# EAGLE design INTERFACE_STM32F103CBT6 (EAGLE 7.6.0)
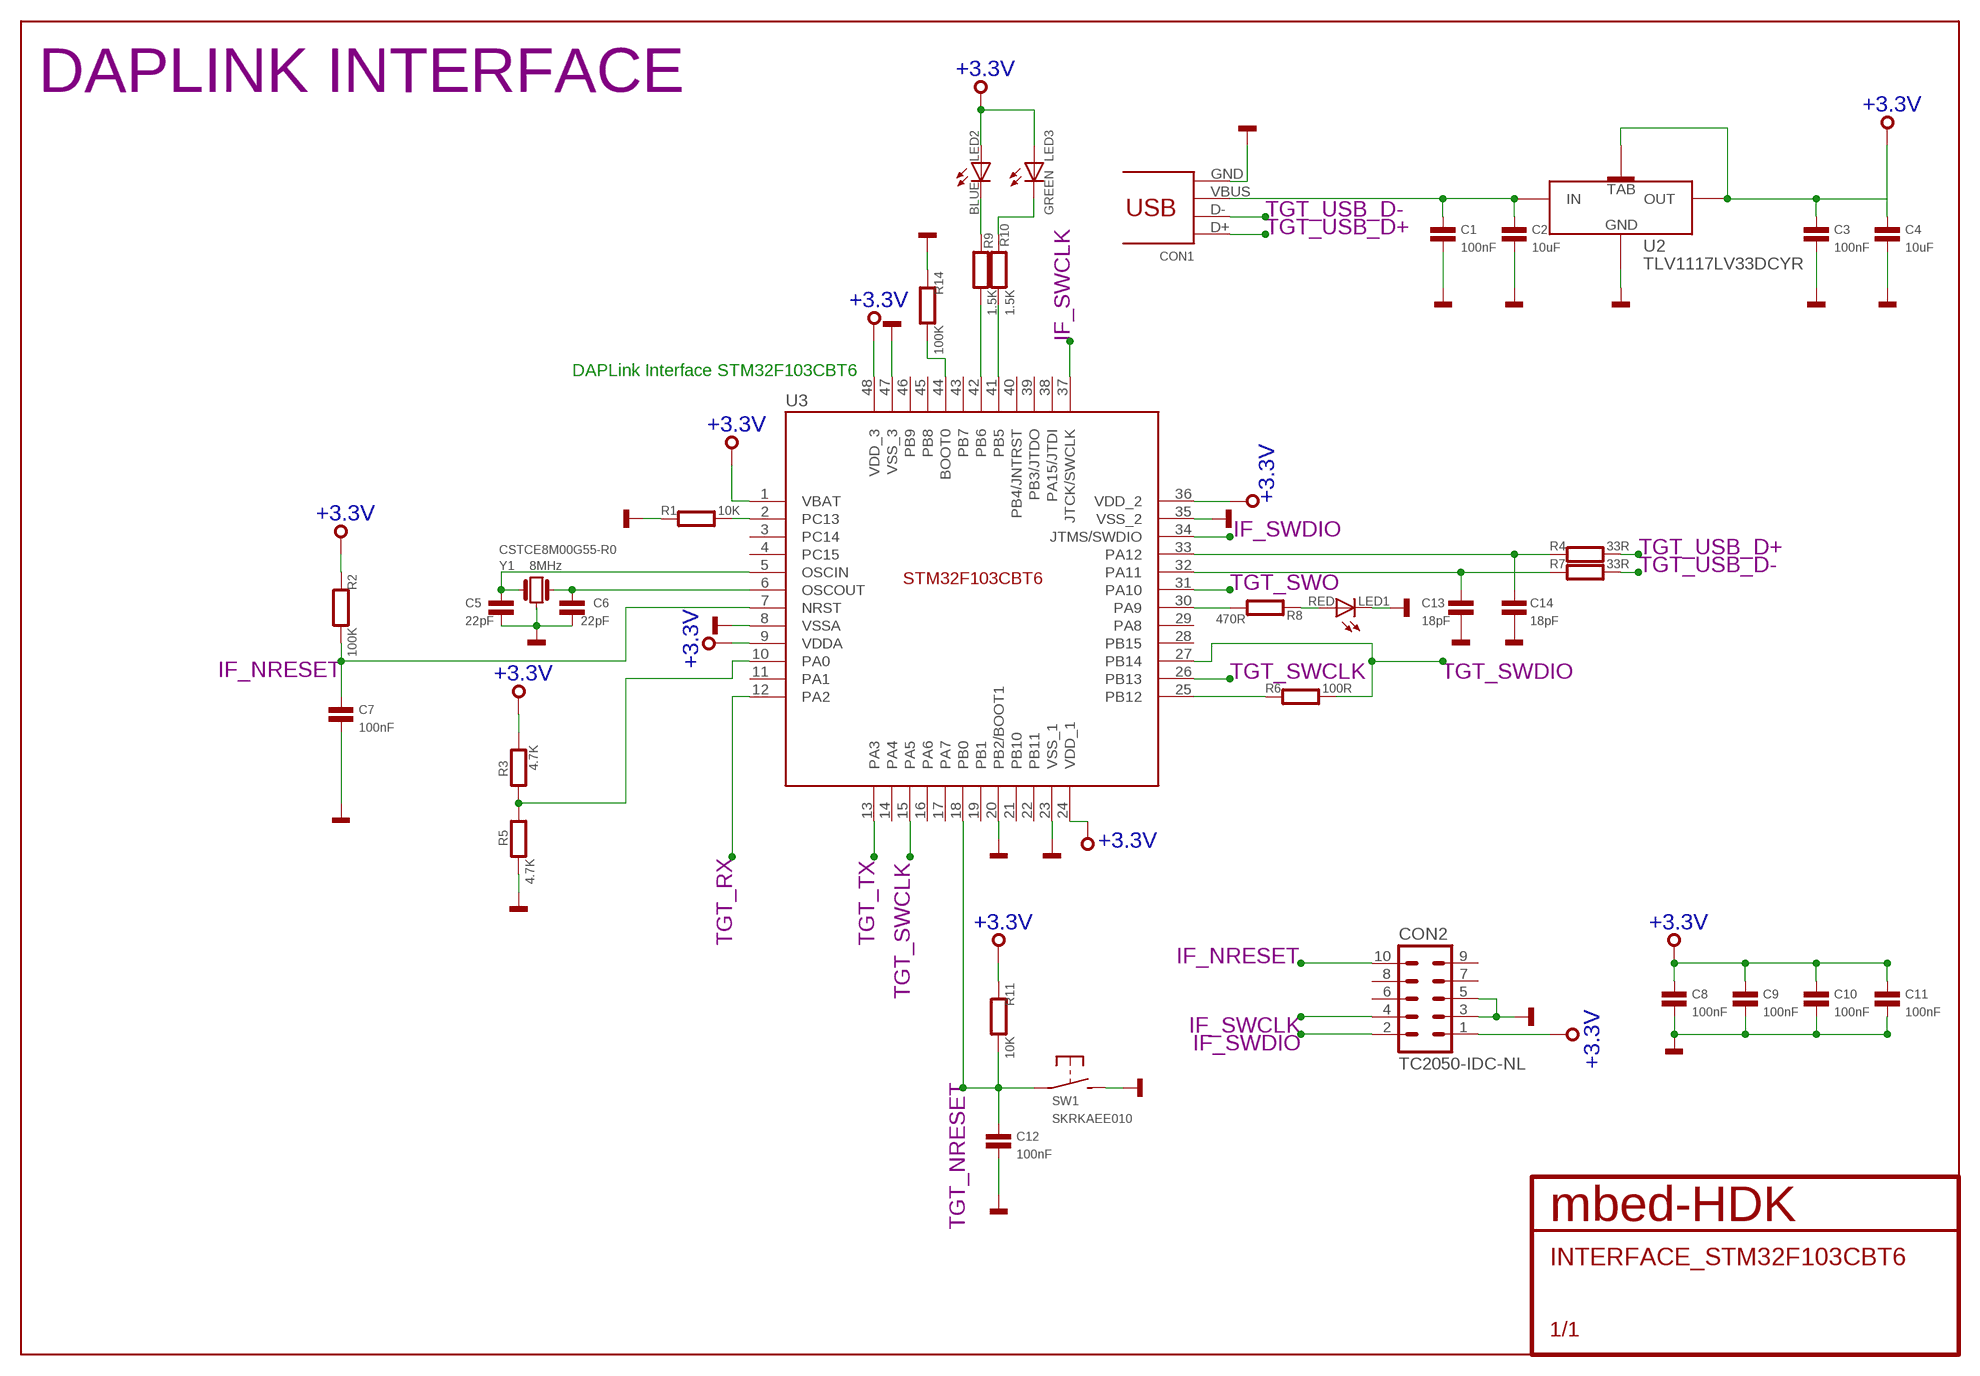
[diagram p0: schematic, sheet 1]

## Parts
C1  100nF  CAPACITOR0402  [0402]
C2  10uF  CAPACITOR0603  [0603]
C3  100nF  CAPACITOR0402  [0402]
C4  10uF  CAPACITOR0603  [0603]
C5  22pF  CAPACITOR0402  [0402]
C6  22pF  CAPACITOR0402  [0402]
C7  100nF  CAPACITOR0402  [0402]
C8  100nF  CAPACITOR0402  [0402]
C9  100nF  CAPACITOR0402  [0402]
C10  100nF  CAPACITOR0402  [0402]
C11  100nF  CAPACITOR0402  [0402]
C12  100nF  CAPACITOR0402  [0402]
C13  18pF  CAPACITOR0402  [0402]
C14  18pF  CAPACITOR0402  [0402]
CON1  47346-0001  [USB-MICRO-B-H]
CON2  TC2050-IDC-NL  [TC2050-IDC-NL]
LED1  RED  SMD_LED0603  [CHIPLED_0603]
LED2  BLUE  SMD_LED0603  [CHIPLED_0603]
LED3  GREEN  SMD_LED0603  [CHIPLED_0603]
R1  10K  RESISTOR0402  [0402]
R2  100K  RESISTOR0402  [0402]
R3  4.7K  RESISTOR0402  [0402]
R4  33R  RESISTOR0402  [0402]
R5  4.7K  RESISTOR0402  [0402]
R6  100R  RESISTOR0402  [0402]
R7  33R  RESISTOR0402  [0402]
R8  470R  RESISTOR0402  [0402]
R9  1.5K  RESISTOR0402  [0402]
R10  1.5K  RESISTOR0402  [0402]
R11  10K  RESISTOR0402  [0402]
R14  100K  RESISTOR0402  [0402]
SW1  SKRKAEE010  [SKRKAEE010]
U2  TLV1117LV33DCYR  [SOT223]
U3  STM32F103CBT6  [LQFP48]
Y1  CSTCE8M00G55-R0  [CSTCE8M00G55-R0]

## Nets
+3.3V: C3.1 C4.1 C8.1 C9.1 C10.1 C11.1 CON2.1 LED2.A LED3.A R2.1 R3.1 R11.1 U2.OUT(1)(OUT) U2.OUT(2)(TAB) U3.1(VBAT) U3.9(VDDA) U3.24(VDD_1) U3.36(VDD_2) U3.48(VDD_3)
GND: C1.2 C2.2 C3.2 C4.2 C5.2 C6.2 C7.2 C8.2 C9.2 C10.2 C11.2 C12.2 C13.2 C14.2 CON1.GND CON2.3 CON2.5 LED1.C R1.1 R5.2 R14.1 SW1.P$2(S) U2.GND U3.8(VSSA) U3.20(PB2/BOOT1) U3.23(VSS_1) U3.35(VSS_2) U3.47(VSS_3) Y1.2
IF_NRESET: C7.1 CON2.10 R2.2 U3.7(NRST)
IF_SWCLK: CON2.4 U3.37(JTCK/SWCLK)
IF_SWDIO: CON2.2 U3.34(JTMS/SWDIO)
N$1: C1.1 C2.1 CON1.VBUS U2.IN
N$2: R8.2 U3.30(PA9)
N$3: R14.2 U3.44(BOOT0)
N$4: R1.2 U3.2(PC13)
N$5: C6.1 U3.6(OSCOUT) Y1.3
N$6: C5.1 U3.5(OSCIN) Y1.1
N$8: R3.2 R5.1 U3.10(PA0)
N$9: R9.2 U3.42(PB6)
N$10: R10.2 U3.41(PB5)
N$11: LED1.A R8.1
N$12: R6.1 U3.25(PB12)
N$13: LED2.C R9.1
N$14: LED3.C R10.1
N$15: C14.1 R4.1 U3.33(PA12)
N$17: C13.1 R7.1 U3.32(PA11)
TGT_NRESET: C12.1 R11.2 SW1.P$1(P) U3.18(PB0)
TGT_RX: U3.12(PA2)
TGT_SWCLK: U3.15(PA5) U3.26(PB13)
TGT_SWDIO: R6.2 U3.27(PB14)
TGT_SWO: U3.31(PA10)
TGT_TX: U3.13(PA3)
TGT_USB_D+: CON1.D+ R4.2
TGT_USB_D-: CON1.D- R7.2
Unconnected: CON2.6 CON2.7 CON2.8 CON2.9 U3.3(PC14) U3.4(PC15) U3.11(PA1) U3.14(PA4) U3.16(PA6) U3.17(PA7) U3.19(PB1) U3.21(PB10) U3.22(PB11) U3.28(PB15) U3.29(PA8) U3.38(PA15/JTDI) U3.39(PB3/JTDO) U3.40(PB4/JNTRST) U3.43(PB7) U3.45(PB8) U3.46(PB9)

## Notes on the sheet
- DAPLINK INTERFACE
- DAPLink Interface STM32F103CBT6
- 8MHz

## Library data of the parts
C1 C3 C7-C12 = mbed-HDK-RLCQ:CAPACITOR: Capacitor
C2 C4-C6 C13 C14 = mbed-HDK-RLC:CAPACITOR: Capacitor
CON1 = mbed-HDK-Connector:47346-0001: USB Receptacle Horizontal Micro Type B; MF: MOLEX; MFN: 47346-0001; OC-MOUSER: 538-47346-0001; OC-NEWARK: 1568026
CON2 = mbed-HDK-Connector:TC2050-IDC: Tag-Connect In Circuit Programming & Debug Cable 10 Pin
LED1-LED3 = mbed-HDK-Optical:SMD_LED: LED SMD, Colour Red; MF: Wurth Electronics Inc; MFN: 150060RS75000; OC-DIGIKEY: 732-4978-1-ND; OC-MOUSER: 710-150060RS75000; OC-NEWARK: 2322071
R1 R4 R6 R7 = mbed-HDK-RLC:RESISTOR: Resistor
R2 R3 R5 R8-R11 R14 = mbed-HDK-RLCQ:RESISTOR: Resistor
SW1 = mbed-HDK-Switch:SKRKAEE010: MOMENTARY SWITCH PUSH VERTICAL (SPST); MF: ALPS; MFN: SKRKAEE010; OC-MOUSER: 688-SKRKAE
U2 = mbed-HDK-Power:TLV1117LV33DCYR: LDO Fixed Regulator 3.3v, 1A; MF: Texas Instruments; MFN: TLV1117LV33DCYR; OC-DIGIKEY: 296-28778-1-ND; OC-MOUSER: 595-TLV1117LV33DCYR; OC-NEWARK: 2323647
U3 = mbed-HDK-MF-ST:STM32F103CBT6: ARM® Cortex®-M3 STM32 F1 Microcontroller IC 32-Bit 72MHz 128KB (128K x 8) FLASH; MF: STMicroelectronics; MFN: STM32F103CBT6; OC-DIGIKEY: 497-6288-ND; OC-MOUSER: 511-STM32F103CBT6; OC-NEWARK: 11N8296
Y1 = mbed-HDK-Oscillator:CSTCE8M00G55-R0: Resonator Cermanic, Murata 8MHz 33pF; MF: Murata; MFN: CSTCE8M00G55-R0; OC-DIGIKEY: 490-1195-1-ND; OC-MOUSER: 81-CSTCE8M00G55-R0; OC-NEWARK: 2443270

## Board
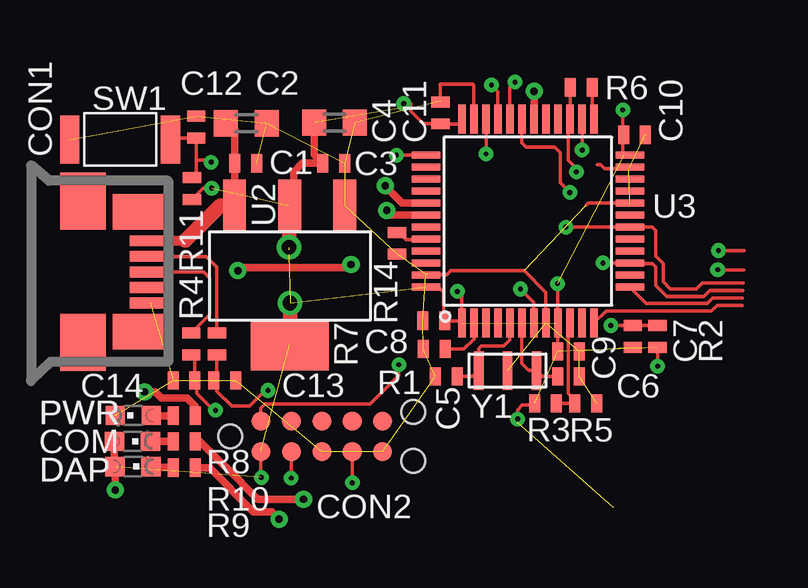
[diagram p1: board, top side]
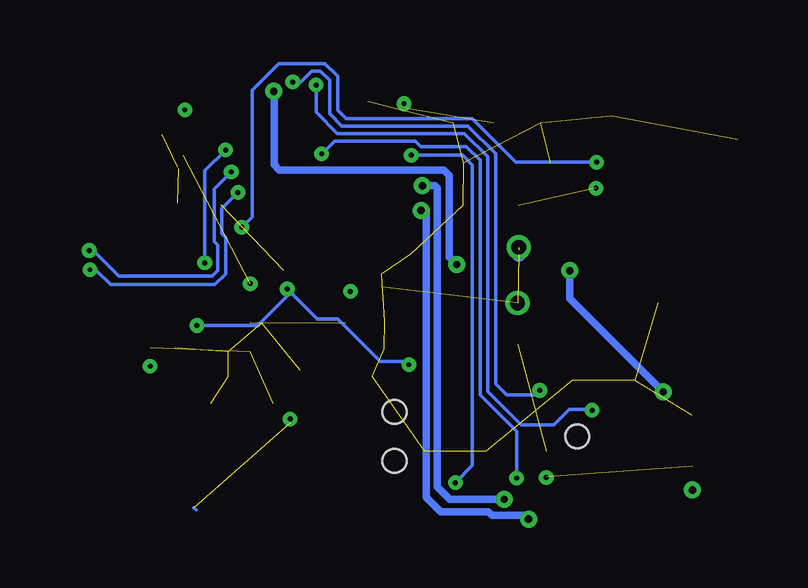
[diagram p2: board, bottom side, seen from below]

No outline drawn. Coordinates in mm, seen from the top.
Copper layers ((1*16)): Top 0.035mm / dielectric 0.8mm / Bottom 0.035mm
Design rules "mbed-HDK-6-6-2-layer": minimum track width 6mil, minimum drill 9mil, track to track 6mil, track to pad 6mil, pad to pad 6mil, via to via 6mil, smd to smd 6mil, copper to edge 15mil, drill to drill 8mil, minimum pad ring 10mil, minimum via ring 8mil, stop-mask expansion 4mil, vias tented up to drill 0mil, thermal gap 10mil

### Footprints (pad centres in the part's own frame; a part is rotated, then mirrored left to right if it is on the bottom)
0402 = smd 0.457 x 0.762: 1 -0.457,0; 2 0.457,0
0603 = smd 1 x 1.1: 1 -0.85,0; 2 0.85,0
USB-MICRO-B-H = smd 1.7 x 0.45: 4 2.8,-0.65; D+ 2.8,0; D- 2.8,0.65; GND 2.8,-1.3; VBUS 2.8,1.3 | smd 1.9 x 2.375: GND1 0,2.95; GND4 0,-2.95 | smd 2.1 x 1.475: GND2 2.3,2.5; GND3 2.3,-2.5
TC2050-IDC-NL = smd 0.787 x 0.787: 1 -2.54,-0.635; 2 -1.27,-0.635; 3 0,-0.635; 4 1.27,-0.635; 5 2.54,-0.635; 6 2.54,0.635; 7 1.27,0.635; 8 0,0.635; 9 -1.27,0.635; 10 -2.54,0.635 | hole 0.991: -3.81,0; 3.81,1.016; 3.81,-1.016
CHIPLED_0603 = smd 0.8 x 0.8: A 0,-0.75; C 0,0.75
SKRKAEE010 = smd 0.8 x 2: P$1 -2.1,0; P$2 2.1,0
SOT223 = smd 0.95 x 2.15: GND -2.3,-5.8; IN 2.3,-5.8; OUT(1) 0,-5.8 | smd 3.25 x 2.15: OUT(2) 0,0
LQFP48 = smd 0.3 x 1.2: 1 0,0; 2 0.5,0; 3 1,0; 4 1.5,0; 5 2,0; 6 2.5,0; 7 3,0; 8 3.5,0; 9 4,0; 10 4.5,0; 11 5,0; 12 5.5,0; 25 5.5,8.5; 26 5,8.5; 27 4.5,8.5; 28 4,8.5; 29 3.5,8.5; 30 3,8.5; 31 2.5,8.5; 32 2,8.5; 33 1.5,8.5; 34 1,8.5; 35 0.5,8.5; 36 0,8.5 | smd 1.2 x 0.3: 13 7,1.5; 14 7,2; 15 7,2.5; 16 7,3; 17 7,3.5; 18 7,4; 19 7,4.5; 20 7,5; 21 7,5.5; 22 7,6; 23 7,6.5; 24 7,7; 37 -1.5,7; 38 -1.5,6.5; 39 -1.5,6; 40 -1.5,5.5; 41 -1.5,5; 42 -1.5,4.5; 43 -1.5,4; 44 -1.5,3.5; 45 -1.5,3; 46 -1.5,2.5; 47 -1.5,2; 48 -1.5,1.5
CSTCE8M00G55-R0 = smd 0.4 x 1.6: 1 2.4,0; 2 1.2,0; 3 0,0

### Placement (x,y rotation side)
C1  10.35,16.82 0 top
C2  10.37,18.49 0 top
C3  14.01,16.82 0 top
C4  14.05,18.52 0 top
C5  18.71,7.94 180 top
C6  23.79,7.93 0 top
C7  26.47,9.6 270 top
C8  18.19,10.26 180 top
C9  23.79,8.97 0 top
C10  26.54,18.01 0 top
C11  18.47,18.92 90 top
C12  8.28,18.34 90 top
C13  9.47,7.77 0 top
C14  7.77,7.77 180 top
CON1  3.56,12.29 0 top
CON2  13.51,5.44 0 top
LED1  5.66,6.31 90 top
LED2  5.65,4.18 270 top
LED3  5.63,5.23 270 top
R1  18.21,9.08 0 top
R2  27.5,9.6 90 top
R3  22.83,6.81 0 top
R4  8.08,9.3 90 top
R5  24.52,6.81 0 top
R6  24.33,19.99 180 top
R7  9.14,9.3 90 top
R8  7.79,6.3 0 top
R9  7.78,4.13 0 top
R10  7.79,5.23 0 top
R11  8.1,15.77 90 top
R14  16.65,13.49 90 top
SW1  5.11,17.82 180 top
U2  12.17,9.26 180 top
U3  19.35,10.16 0 top
Y1  22.45,8.18 180 top

### Tracks (layer width: path | path; a pad name or v marks a point on that pad's centre or on a via)
+3.3V  (via drill 0.2, 0.3, 0.61)  (12 unrouted)
  Top 0.152: U3.9 23.34,10.14 C9.1 v23.34,11.8 | R3.1 22.31,6.74 21.88,6.74 21.67,6.54 v21.67,6.16 | U3.24 26.12,17.16 26.06,17.22 26.06,17.98 | 26.06,17.98 C10.1 | 26.06,17.98 v26.06,19.05 | U3.36 19.17,18.47 C11.1 18.45,18.48 17.75,18.48 17.22,19.01 17.22,19.31 v16.93,19.31 | U3.48 18.36,11.66 18.59,11.43 18.59,10.31 C8.1 19.26,10.26 U3.1 19.36,11.29 v19.16,11.48 | CON2.1 10.97,3.75 v11,3.72 | R2.1 v27.5,8.37 v27.51,8.36 | R11.1 8.57,15.79 v8.93,15.79
  Top 0.305: C4.1 13.2,17.18 C3.1 12.71,16.82 12.34,16.46 12.34,15.21 12.19,15.06 | LED3.A 4.88,4.2 LED2.A 4.9,3.3 v4.91,3.2
  Top 0.61: U2.OUT(2) 12.19,9.26 v12.19,11 | 12.19,15.06 U2.OUT(1) v12.15,13.32
  Bottom 0.152: 25.68,2.46 25.58,2.36 | v21.67,6.16 21.65,6.14 21.65,6.02 | v26.06,19.05 26.05,19.05 26.01,19.09 | v19.16,11.48 19.14,11.48 19.13,11.46 | v23.34,11.8 23.34,11.54 23.39,11.59 | v11,3.72 11,3.65 11.02,3.63 | v27.51,8.36 27.51,8.31 27.57,8.25 | v16.93,19.31 16.81,19.13 16.8,19.13 | v8.93,15.79 8.91,15.84 8.91,15.96
  Bottom 0.305: v4.91,3.2 4.9,3.07 4.89,3.05
  Bottom 0.61: 12.15,13.01 12.14,13.21 12.13,13.21
GND  (26 unrouted)
  Top 0.152: U3.8 22.86,11.44 21.95,12.34 18.9,12.34 18.75,12.19 17.89,12.19 U3.47 | U3.20 24.61,15.16 24.54,15.09 | 24.99,16.76 25.15,16.76 25.3,16.61 26.31,16.61 U3.23 | U3.35 19.86,20.07 19.81,20.12 18.44,20.12 18.44,19.41 C11.2
IF_NRESET  (via drill 0.2)
  Top 0.152: U3.7 22.36,11.02 v21.79,11.58 | v25.56,10.06 C7.1 R2.2 | CON2.10 10.97,6.6 11.16,6.79 14.48,6.79 14.49,6.78 15.54,6.78 16.73,7.97 v16.73,8.43
  Bottom 0.152: v25.56,10.06 23.01,10.06 21.64,11.43 21.64,11.73 v21.79,11.58 20.54,10.33 19.69,10.33 17.91,8.55 16.85,8.55 v16.73,8.43
IF_SWCLK  (via drill 0.2)
  Top 0.152: U3.37 v16.63,17.16 v16.62,17.16 | v14.79,3.5 CON2.4
  Bottom 0.152: v16.62,17.16 14.48,17.16 14.08,16.76 14.08,4.22 v14.79,3.5
IF_SWDIO  (via drill 0.2)
  Top 0.152: CON2.2 v12.24,3.7 | v20.36,17.21 U3.34
  Bottom 0.152: v12.24,3.7 12.24,5.64 13.75,7.16 13.75,16.95 14.33,17.53 16.22,17.53 16.45,17.75 19.82,17.75 v20.36,17.21
N$1
  Top 0.305: U2.IN 9.89,15.06 C1.1 9.89,18.12 arc90 C2.1
  Top 0.406: CON1.VBUS 7.83,13.6
  Top 0.61: 7.83,13.6 9.29,15.06 U2.IN
N$2  (via drill 0.3)
  Top 0.305: U3.30 v22.36,19.82 | R8.2 8.24,6.69 7.89,7.04 6.83,7.04 6.58,7.29 v6.13,7.29 | v10.02,12.34 10.16,12.48 14.61,12.48 v14.73,12.61
  Bottom 0.305: v22.36,19.82 22.33,19.8 22.33,16.76 22.12,16.55 15.27,16.55 15.04,16.31 15.04,12.91 v14.73,12.61 | v10.02,12.34 10.02,11.18 v6.13,7.29
N$3
  Top 0.152: R14.2 16.69,13.95 17,13.63 17.83,13.63 U3.44
N$4
  Top 0.152: R1.2 19.44,9.08 19.86,9.5 U3.2
N$5
  Top 0.152: U3.6 21.84,10.15 21.84,8.47 22.14,8.18 Y1.3 22.7,7.93 C6.1
N$6
  Top 0.152: U3.5 21.34,10.14 21.34,9.46 21.09,9.21 20.17,9.21 20.05,9.09 Y1.1 19.81,7.94 C5.1
N$8
  Top 0.152: U3.10 23.79,10.1 23.79,7.22 24.07,6.95 R5.1 R3.2
N$9  (via drill 0.3)
  Top 0.305: U3.42 16.42,14.66 v16.22,14.86 | R9.2 8.26,4.12 8.84,4.12 10.67,2.29 11.43,2.29 v11.73,1.98
  Bottom 0.305: v16.22,14.86 16.14,14.86 16.01,14.73 16.01,2.9 15.39,2.29 13.41,2.29 13.26,2.13 11.89,2.13 v11.73,1.98
N$10  (via drill 0.3)
  Top 0.305: R10.2 8.44,5.23 9.5,4.17 9.51,4.17 10.85,2.82 v12.74,2.82 v12.75,2.81 | U3.41 16.87,15.16 16.29,15.73 16.29,15.75 v16.16,15.89
  Bottom 0.305: v16.16,15.89 15.65,15.89 15.54,15.78 15.54,3.33 15.02,2.81 v12.75,2.81
N$11
  Top 0.305: LED1.A R8.1
N$12
  Top 0.152: U3.25 arc-90 24.79,18.72 R6.1
N$13
  Top 0.305: LED2.C 6.45,4.13 R9.1
N$14
  Top 0.305: LED3.C R10.1
N$15  (via drill 0.2)
  Top 0.152: R4.1 8.23,8.69 C14.1 8.3,7.7 8.3,7.23 9.01,6.52 v9.09,6.52 | U3.33 20.86,19.82 v20.59,20.09
  Bottom 0.152: v20.59,20.09 20.59,18.95 19.7,18.07 14.41,18.07 13.44,17.09 13.44,7.32 12.03,5.91 10.69,5.91 10.04,6.57 9.13,6.57 v9.09,6.52
N$17  (via drill 0.2)
  Top 0.152: U3.32 21.36,20 v21.57,20.21 | v11.27,7.35 11.12,7.32 10.52,6.71 9.75,6.71 9.14,7.32 9.14,7.64 C13.1 9.14,7.91 R7.1
  Bottom 0.152: v21.57,20.21 21.23,20.21 20.77,20.67 20.41,20.67 20.02,20.28 20.02,18.89 19.51,18.38 14.26,18.38 13.11,17.22 13.11,7.62 12.65,7.16 11.43,7.16 v11.27,7.35
TGT_NRESET  (via drill 0.2)
  Top 0.152: SW1.P$1 7.28,17.88 C12.1 8.28,16.95 | R11.2 8.28,16.41 8.28,16.95 | 31.08,11.83 29.36,11.83 29.11,11.58 28.04,11.58 27.74,11.89 27.74,12.65 27.43,12.95 27.43,14.02 27.29,14.16 U3.18 v23.69,14.16 | v8.9,16.87 8.81,16.95 8.28,16.95
  Bottom 0.152: v23.69,14.16 23.26,14.59 23.26,19.88 22.16,20.98 20.23,20.98 19.69,20.45 19.69,19.04 19.34,18.69 17.48,18.69 17.47,18.68 14.09,18.68 12.28,16.87 v8.9,16.87
TGT_RX
  Top 0.152: U3.12 25.36,10.67 29.75,10.67 29.98,10.9 31.03,10.9
TGT_SWCLK  (via drill 0.2)
  Top 0.152: 31.05,11.52 29.68,11.52 29.44,11.28 27.89,11.28 27.43,11.73 27.43,12.5 27.28,12.65 26.37,12.65 U3.15 25.31,12.66 25.3,12.65 25.25,12.65 v25.23,12.67 | v24.36,17.38 U3.26
  Bottom 0.152: v25.23,12.67 25.23,16.51 v24.36,17.38
TGT_SWDIO  (via drill 0.2)
  Top 0.152: R6.2 23.88,18.68 arc-90 U3.27 23.79,18.6 23.79,16.95 24.12,16.62 v24.12,16.47 | v30.04,13.18 31.11,13.18
  Bottom 0.152: v24.12,16.47 24.84,15.75 24.84,13.56 24.69,13.41 24.69,12.34 24.91,12.12 28.81,12.12 29.87,13.18 v30.04,13.18
TGT_SWO  (via drill 0.2)
  Top 0.152: U3.31 21.84,17.68 22.04,17.49 23.23,17.49 23.45,17.27 23.45,16.02 23.85,15.62 v23.85,15.61 | v30.01,12.38 31.1,12.38
  Bottom 0.152: v23.85,15.61 24.52,14.94 24.52,13.89 24.36,13.73 24.36,12.21 24.81,11.76 28.84,11.76 28.84,11.77 29.15,11.77 29.77,12.38 v30.01,12.38
TGT_TX
  Top 0.152: U3.13 27.04,10.97 29.57,10.97 29.81,11.21 31.03,11.21
TGT_USB_D+
  Top 0.152: CON1.D+ 8.59,12.29 8.84,12.04 8.84,10.52 R4.2
TGT_USB_D-
  Top 0.152: CON1.D- 8.7,12.94 9.14,12.5 R7.2

### Text on the board
tPlace: PWR | PWR | COM | DAP | DAP